# EAGLE design feather-power-switch-i2c-spi-breakout-mk-1.0 (EAGLE 6.5.0)
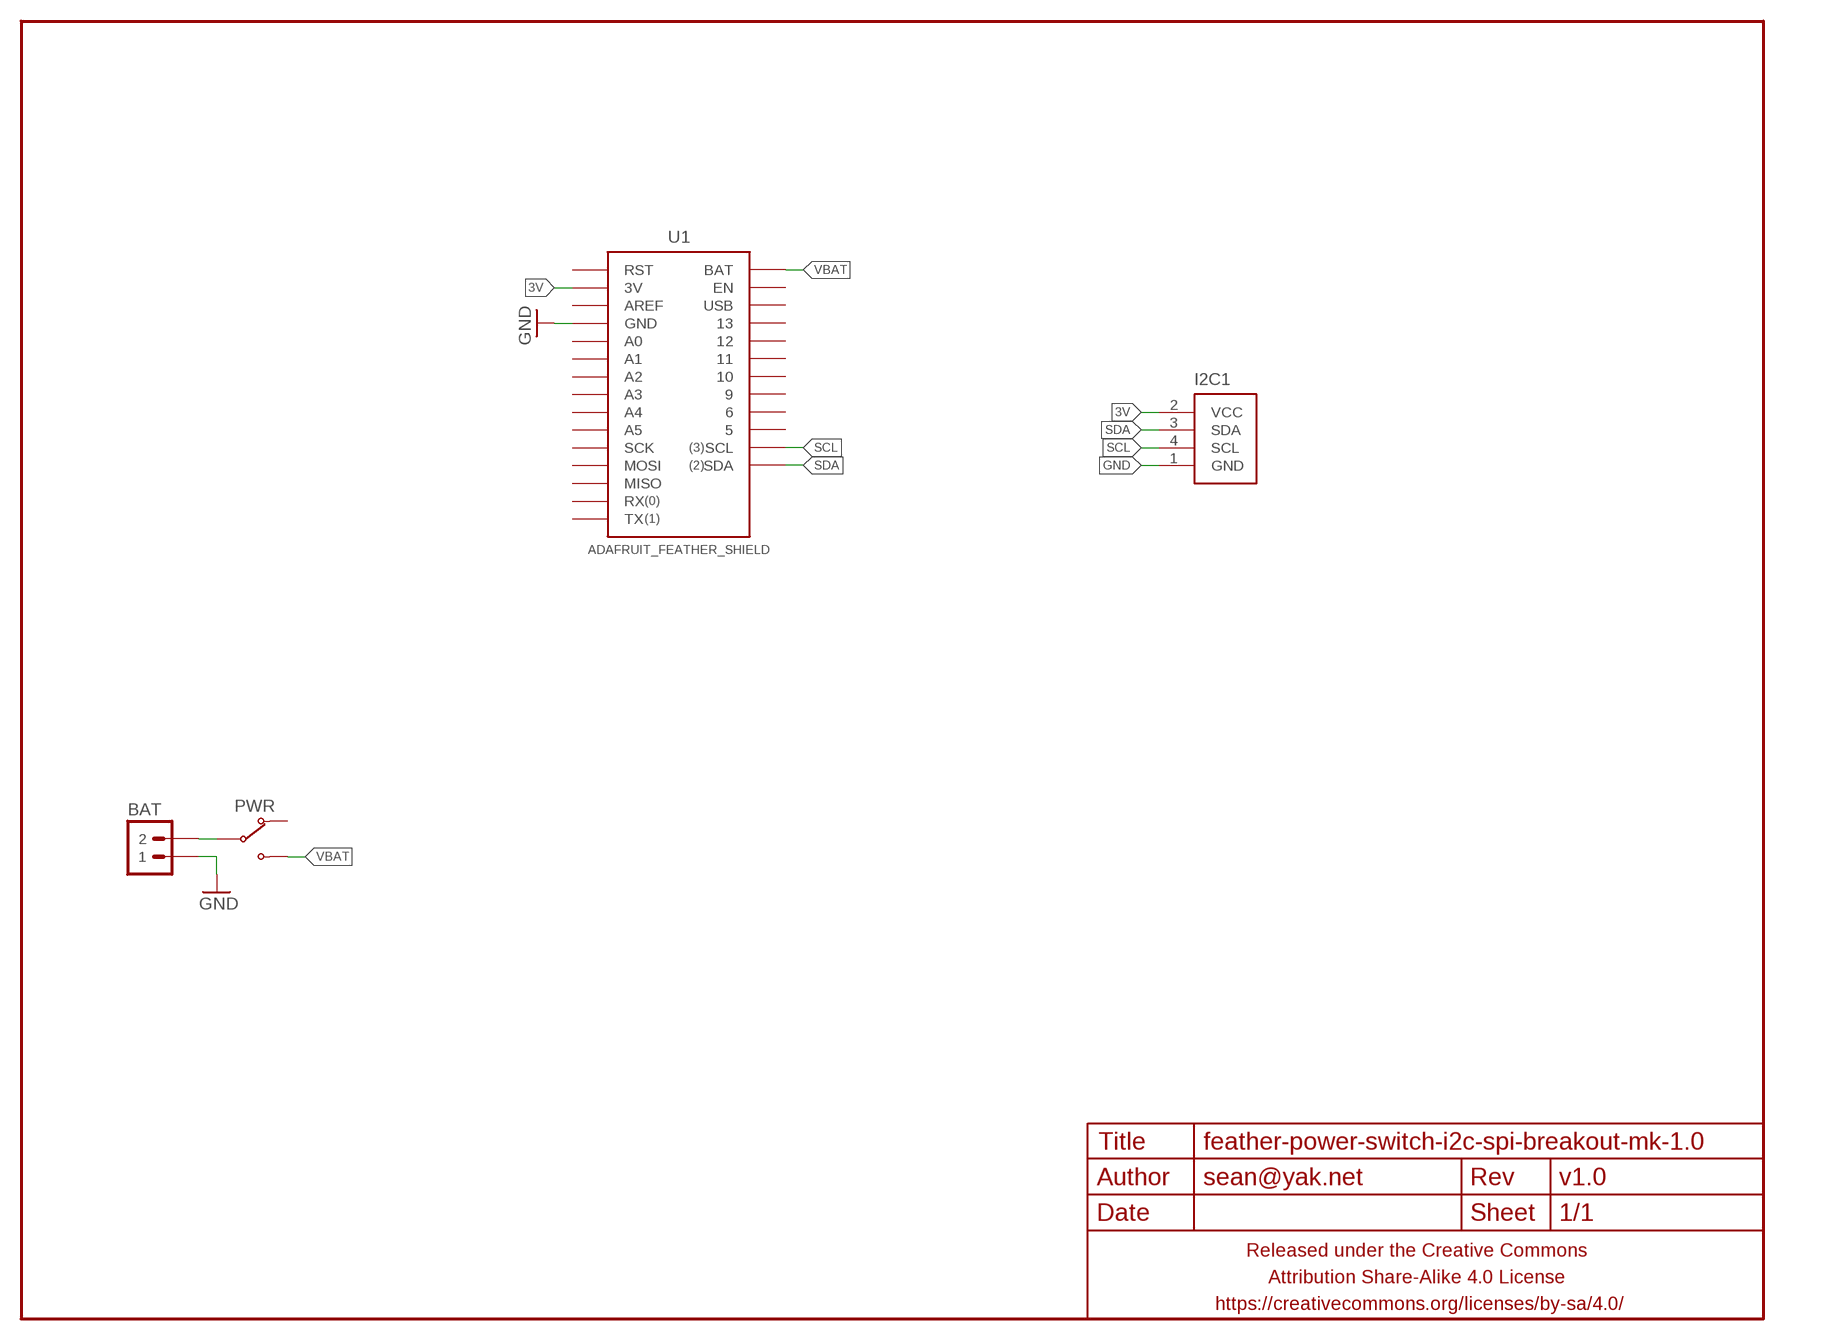
[diagram p0: schematic, sheet 1]

## Parts
BAT  M02JST-PTH-RA-R+  [JST-2-PH-RA-PTH-R+]
FRAME1  FRAME-LETTERNO_PACKAGE  [DUMMY]
I2C1  M04-I2CJST-4-PH-VERT-CENTERED-I2C  [JST-4-PH-VERT-PTH-CENTERED-I2C]
PWR  SWITCH-SPDTPTH-RA-2.54MM  [SPDT-RA-2.54MM]
U1  ADAFRUIT_FEATHER_SHIELD  [ADAFRUIT_FEATHER]

## Nets
3V: I2C1.2(VCC) U1.3V
GND: BAT.1 I2C1.1(GND) U1.GND@0(GND) U1.GND@1(GND)
N$1: BAT.2 PWR.2(COM)
SCL: I2C1.4(SCL) U1.SCL
SDA: I2C1.3(SDA) U1.SDA
VBAT: PWR.3(NO) U1.BAT
Unconnected: PWR.1(NC) U1.5 U1.6 U1.9 U1.10 U1.11 U1.12 U1.13 U1.A0 U1.A1 U1.A2 U1.A3 U1.A4 U1.A5 U1.AREF U1.EN U1.MISO U1.MOSI U1.RST U1.RX U1.SCK U1.TX U1.USB

## Library data of the parts
BAT = a_parts:M02: Standard 2-pin 0.1" header. Use with - straight break away headers ( PRT-00116) - right angle break away headers (PRT-00553) - swiss pins (PRT-00743) - machine pins (PRT-00117) - female headers (PRT-00115) Molex polarized connector foot print use with: PRT-08233 with associated crimp pins and housings. 2.54_SCREWTERM for use with PRT-10571. 3.5mm Screw Terminal footprints for PRT-08084 5mm Screw Terminal footprints for use with PRT-08433
FRAME1 = a_parts:FRAME-LETTER: Schematic Frame Standard 8.5x11 US Letter frame; DESIGNER: sean@yak.net; VERSION: v1.0
I2C1 = a_parts:M04-I2C
PWR = a_parts:SWITCH-SPDT
U1 = a_parts:ADAFRUIT_FEATHER_SHIELD

## Board
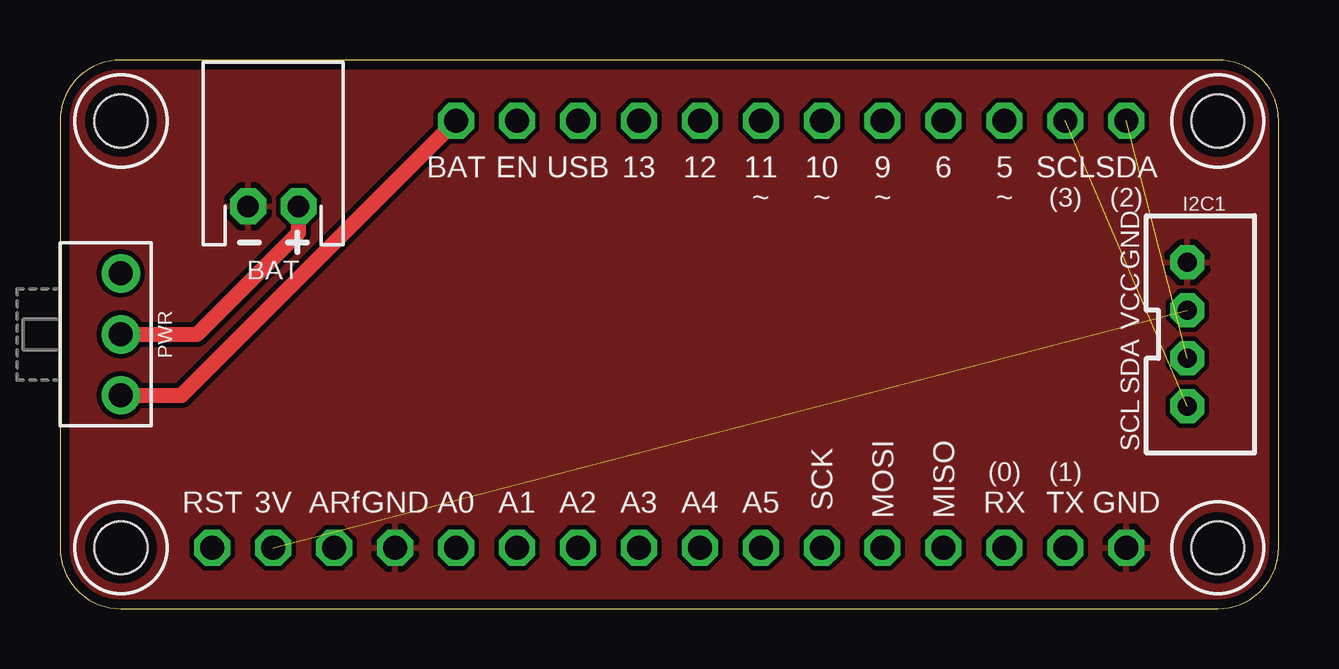
[diagram p1: board, top side]
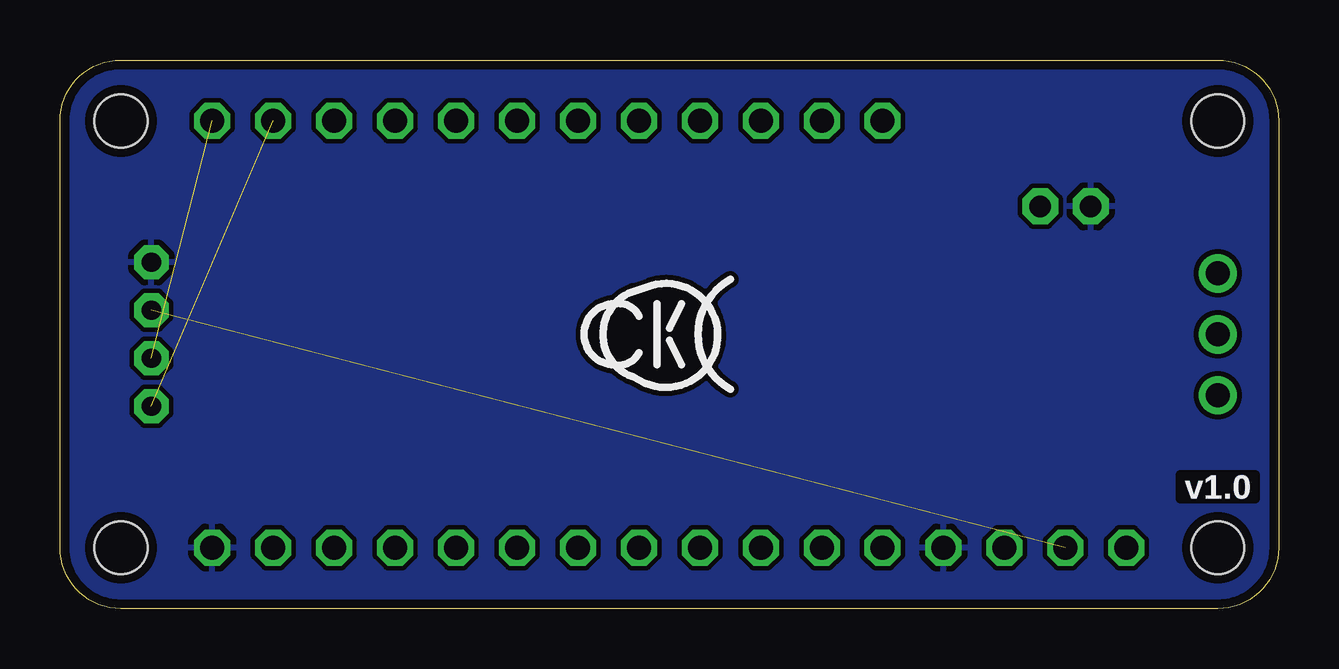
[diagram p2: board, bottom side, seen from below]

Size 50.8 x 22.86 mm. Coordinates in mm from the lower left corner, seen from the top.
Outline: 0,20.32 0,2.54 arc90 2.54,0 48.26,0 arc90 50.8,2.54 50.8,20.32 arc90 48.26,22.86 2.54,22.86 arc90 0,20.32
Copper layers (1*16): Top 0.0356mm / dielectric 1.5011mm / Bottom 0.0356mm
Design rules "LaenPCBOrder_2": minimum track width 6mil, minimum drill 13mil, track to track 6mil, track to pad 6mil, pad to pad 6mil, via to via 6mil, smd to smd 6mil, copper to edge 15mil, drill to drill 6mil, minimum pad ring 7mil, minimum via ring 7mil, stop-mask expansion 3mil, vias tented up to drill 20mil, thermal gap 10mil
Holes 2.2 mm at 2.54,20.32 2.54,2.54 48.26,2.54 48.26,20.32

### Footprints (pad centres in the part's own frame; a part is rotated, then mirrored left to right if it is on the bottom)
JST-2-PH-RA-PTH-R+ = drill 0.9 pad 1.5 octagon: 1 -1.05,0; 2 1.05,0
JST-4-PH-VERT-PTH-CENTERED-I2C = drill 0.8 pad 1.422 octagon: 1 -3,0; 2 -1,0; 3 1,0; 4 3,0
SPDT-RA-2.54MM = drill 1 pad 1.6: 1 0,0; 2 2.54,0; 3 5.08,0
ADAFRUIT_FEATHER = drill 1 pad 1.5 octagon: 3V -16.51,-8.89; 5 13.97,8.89; 6 11.43,8.89; 9 8.89,8.89; 10 6.35,8.89; 11 3.81,8.89; 12 1.27,8.89; 13 -1.27,8.89; A0 -8.89,-8.89; A1 -6.35,-8.89; A2 -3.81,-8.89; A3 -1.27,-8.89; A4 1.27,-8.89; A5 3.81,-8.89; AREF -13.97,-8.89; BAT -8.89,8.89; EN -6.35,8.89; GND@0 -11.43,-8.89; GND@1 19.05,-8.89; MISO 11.43,-8.89; MOSI 8.89,-8.89; RST -19.05,-8.89; RX 13.97,-8.89; SCK 6.35,-8.89; SCL 16.51,8.89; SDA 19.05,8.89; TX 16.51,-8.89; USB -3.81,8.89

### Placement (x,y rotation side)
BAT  8.89,16.76 0 top
FRAME1  0,0 0 top
I2C1  46.99,11.43 270 top
PWR  2.54,13.97 270 top
U1  25.4,11.43 0 top
U$1  [COW_SMALL_METAL_NOTEXT]  25.4,11.43 270 bottom

### Tracks (layer width: path | path; a pad name or v marks a point on that pad's centre or on a via)
3V  (1 unrouted)
GND
  pour Top (isolate 0.2): 50.8,20.32 50.8,2.54 arc-90 48.26,0 2.54,0 arc-90 0,2.54 0,20.32 arc-90 2.54,22.86 48.26,22.86 arc-90
  pour Bottom (isolate 0.2): 50.8,20.32 50.8,2.54 arc-90 48.26,0 2.54,0 arc-90 0,2.54 0,20.32 arc-90 2.54,22.86 48.26,22.86 arc-90
N$1
  Top 0.635: PWR.2 5.71,11.43 9.94,15.65 BAT.2
SCL  (1 unrouted)
SDA  (1 unrouted)
VBAT
  Top 0.635: PWR.3 5.08,8.89 U1.BAT